# EAGLE design headset_v2 (EAGLE 9.5.1)
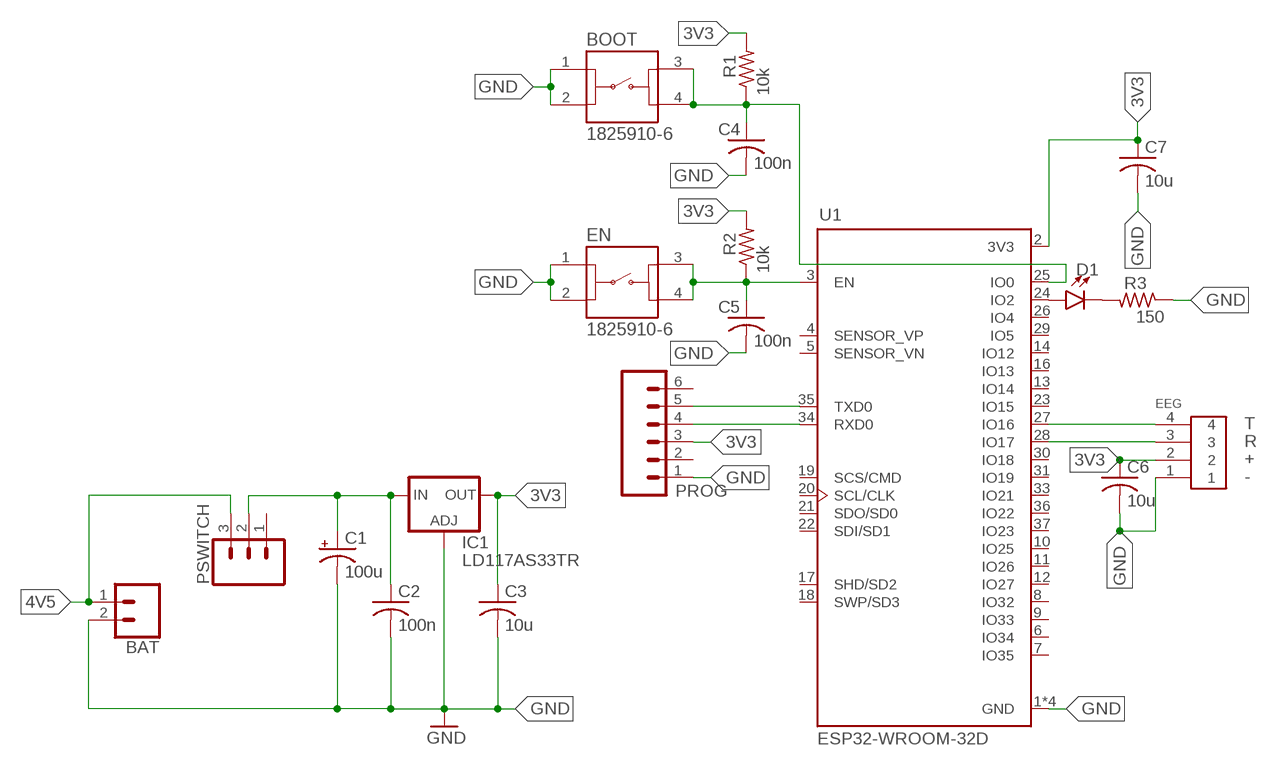
[diagram p0: schematic, sheet 1]

## Parts
BAT  CONN_02  [1X02]
BOOT  1825910-6  [1825910-6]
C1  100u  CPOL-US153CLV-0810  [153CLV-0810]
C2  100n  C-USC0805  [C0805]
C3  10u  C-USC0805  [C0805]
C4  100n  C-USC0805  [C0805]
C5  100n  C-USC0805  [C0805]
C6  10u  C-USC0805  [C0805]
C7  10u  C-USC0805  [C0805]
D1  LED3MM  [LED_3MM]
EEG  2PIN  [B2B-PH-K-S]
EN  1825910-6  [1825910-6]
IC1  LD117AS33TR  [SOT223]
PROG  CONN_06SILK_FEMALE_PTH  [1X06]
PSWITCH  CONN_03  [1X03]
R1  10k  R-US_R0805  [R0805]
R2  10k  R-US_R0805  [R0805]
R3  150  R-US_R0805  [R0805]
U1  ESP32-WROOM-32D  [MODULE_ESP32-WROOM-32D]

## Nets
3V3: C3.1 C6.1 C7.1 EEG.2 IC1.4(OUT) PROG.3 R1.2 R2.2 U1.2(3V3)
4V5: BAT.1 PSWITCH.3
GND: BAT.2 BOOT.1 BOOT.2 C1.- C2.2 C3.2 C4.2 C5.2 C6.2 C7.2 EEG.1 EN.1 EN.2 IC1.1(ADJ) PROG.1 R3.1 U1.1(GND) U1.15(GND) U1.38(GND) U1.39(GND)
N$1: PROG.5 U1.35(TXD0)
N$2: PROG.4 U1.34(RXD0)
N$3: C1.+ C2.1 IC1.3(IN) PSWITCH.2
N$4: D1.A U1.24(IO2)
N$5: EEG.3 U1.28(IO17)
N$6: EEG.4 U1.27(IO16)
N$9: D1.K(C) R3.2
N$10: C5.1 EN.3 EN.4 R2.1 U1.3(EN)
N$14: BOOT.3 BOOT.4 C4.1 R1.1 U1.25(IO0)
Unconnected: PROG.2 PROG.6 PSWITCH.1 U1.4(SENSOR_VP) U1.5(SENSOR_VN) U1.6(IO34) U1.7(IO35) U1.8(IO32) U1.9(IO33) U1.10(IO25) U1.11(IO26) U1.12(IO27) U1.13(IO14) U1.14(IO12) U1.16(IO13) U1.17(SHD/SD2) U1.18(SWP/SD3) U1.19(SCS/CMD) U1.20(SCL/CLK) U1.21(SDO/SD0) U1.22(SDI/SD1) U1.23(IO15) U1.26(IO4) U1.29(IO5) U1.30(IO18) U1.31(IO19) U1.33(IO21) U1.36(IO22) U1.37(IO23)

## Library data of the parts
BAT = SparkFun-Connectors:CONN_02: Multi connection point. Often used as Generic Header-pin footprint for 0.1 inch spaced/style header connections On any of the 0.1 inch spaced packages, you can populate with these: Break Away Headers - Straight <https://www.sparkfun.com/products/116> (PRT-00116) Break Away Male Headers - Right Angle <https://www.sparkfun.com/products/553> (PRT-00553) Female Headers <https://www.sparkfun.com/products/115> (PRT-00115) Break Away Headers - Machine Pin <https://www.sparkfun.com/products/117> (PRT-00117) Break Away Female Headers - Swiss Machine Pin <https://www.sparkfun.com/products/743> (PRT-00743) For SCREWTERMINALS and SPRING TERMINALS visit here: Screw Terimnals on SparkFun.com <https://www.sparkfun.com/search/results?term=Screw+Terminals> (5mm/3.5mm/2.54mm spacing) This device is also useful as a general connection point to wire up your design to another part of your project. Our various solder wires solder well into these plated through hole pads. Hook-Up Wire - Assortment (Stranded, 22 AWG) <https://www.sparkfun.com/products/11375> (PRT-11375) Hook-Up Wire - Assortment (Solid Core, 22 AWG) <https://www.sparkfun.com/products/11367> (PRT-11367) View the entire wire category on our website here <https://www.sparkfun.com/categories/141> Special notes: Molex polarized connector foot print use with: PRT-08233 with associated crimp pins and housings. 2.54_SCREWTERM for use with PRT-10571. 3.5mm Screw Terminal footprints for PRT-08084 5mm Screw Terminal footprints for use with PRT-08432
BOOT EN = Switch:1825910-6: SWITCH TACTILE SPST-NO 0.05A 24V Manufacturer's datasheet <https://www.te.com/commerce/DocumentDelivery/DDEController?Action=srchrtrv&DocNm=1825910&DocType=Customer+Drawing&DocLang=English>; CREATED_BY: PCBLayout.com; DIGIKEY_PART_NUMBER: 450-1650-ND; MANUFACTURER: TE Connectivity ALCOSWITCH Switches; MPN: 1825910-6
C1 = rcl:CPOL-US: POLARIZED CAPACITOR, American symbol; SPICEPREFIX: C
C2-C7 = resistor:C-US: CAPACITOR, American symbol
D1 = SparkFun-LED:LED: LED (Generic) Standard schematic elements and footprints for 5mm, 3mm, 1206, and 0603 sized LEDs. Generic LEDs with no color specified.; PROD_ID: DIO-08794
EEG = jst_eph:2PIN
IC1 = v-reg:LD117A?*: Low drop fixed and adjustable positive voltage regulators 1 A Source: http://www.st.com/stonline/products/literature/ds/7194/ld1117axx.pdf
PROG = SparkFun-Connectors:CONN_06: Multi connection point. Often used as Generic Header-pin footprint for 0.1 inch spaced/style header connections On any of the 0.1 inch spaced packages, you can populate with these: Break Away Headers - Straight <https://www.sparkfun.com/products/116> (PRT-00116) Break Away Male Headers - Right Angle <https://www.sparkfun.com/products/553> (PRT-00553) Female Headers <https://www.sparkfun.com/products/115> (PRT-00115) Break Away Headers - Machine Pin <https://www.sparkfun.com/products/117> (PRT-00117) Break Away Female Headers - Swiss Machine Pin <https://www.sparkfun.com/products/743> (PRT-00743) Arduino Stackable Header - 6 Pin <https://www.sparkfun.com/products/9280> (PRT-09280) For SCREWTERMINALS and SPRING TERMINALS visit here: Screw Terimnals on SparkFun.com <https://www.sparkfun.com/search/results?term=Screw+Terminals> (5mm/3.5mm/2.54mm spacing) This device is also useful as a general connection point to wire up your design to another part of your project. Our various solder wires solder well into these plated through hole pads. Hook-Up Wire - Assortment (Stranded, 22 AWG) <https://www.sparkfun.com/products/11375> (PRT-11375) Hook-Up Wire - Assortment (Solid Core, 22 AWG) <https://www.sparkfun.com/products/11367> (PRT-11367) View the entire wire category on our website here <https://www.sparkfun.com/categories/141>; PROD_ID: CONN-08437
PSWITCH = SparkFun-Connectors:CONN_03: Multi connection point. Often used as Generic Header-pin footprint for 0.1 inch spaced/style header connections On any of the 0.1 inch spaced packages, you can populate with these: Break Away Headers - Straight <https://www.sparkfun.com/products/116> (PRT-00116) Break Away Male Headers - Right Angle <https://www.sparkfun.com/products/553> (PRT-00553) Female Headers <https://www.sparkfun.com/products/115> (PRT-00115) Break Away Headers - Machine Pin <https://www.sparkfun.com/products/117> (PRT-00117) Break Away Female Headers - Swiss Machine Pin <https://www.sparkfun.com/products/743> (PRT-00743) Stackable Header - 3 Pin (Female, 0.1") <https://www.sparkfun.com/products/13875> (PRT-13875) For SCREWTERMINALS and SPRING TERMINALS visit here: Screw Terimnals on SparkFun.com <https://www.sparkfun.com/search/results?term=Screw+Terminals> (5mm/3.5mm/2.54mm spacing) This device is also useful as a general connection point to wire up your design to another part of your project. Our various solder wires solder well into these plated through hole pads. Hook-Up Wire - Assortment (Stranded, 22 AWG) <https://www.sparkfun.com/products/11375> (PRT-11375) Hook-Up Wire - Assortment (Solid Core, 22 AWG) <https://www.sparkfun.com/products/11367> (PRT-11367) View the entire wire category on our website here <https://www.sparkfun.com/categories/141> Special notes: Molex polarized connector foot print use with SKU : PRT-08232 with associated crimp pins and housings.
R1-R3 = rcl:R-US_: RESISTOR, American symbol; SPICEPREFIX: R
U1 = ESP32-WROOM-32D:ESP32-WROOM-32D: IC: SoC; GPIO, I2C, I2S, IR, SD, SDIO, SPI, UART; 2.7÷3.6VDC; 20dBm; AVAILABILITY: Unavailable; DESCRIPTION: IC: SoC; GPIO, I2C, I2S, IR, SD, SDIO, SPI, UART; 2.7÷3.6VDC; 20dBm; MF: Espressif Systems; MP: ESP32-WROOM-32D; PACKAGE: Module Espressif Systems; PRICE: None

## Board
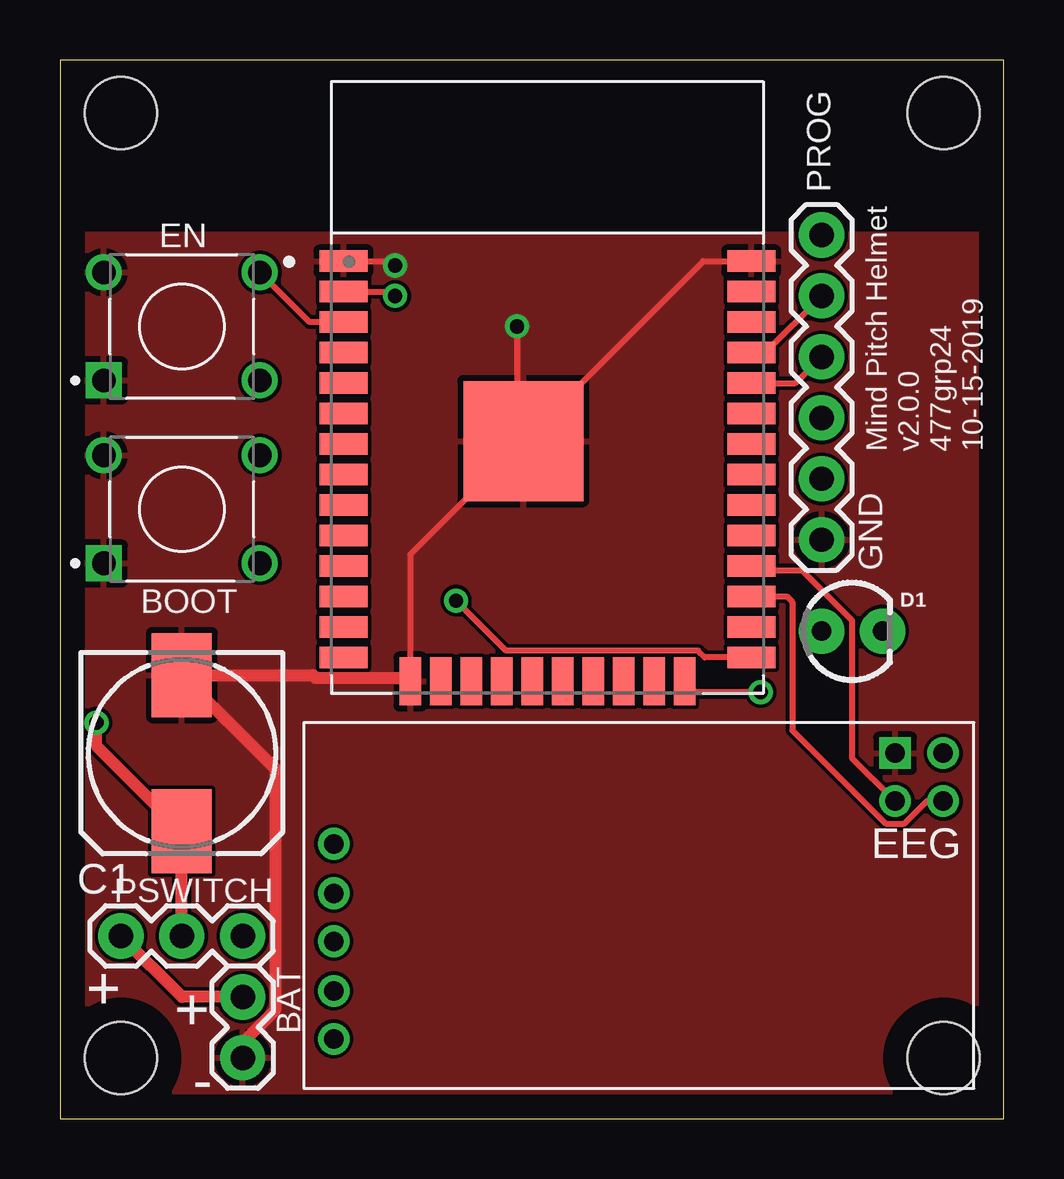
[diagram p1: board, top side]
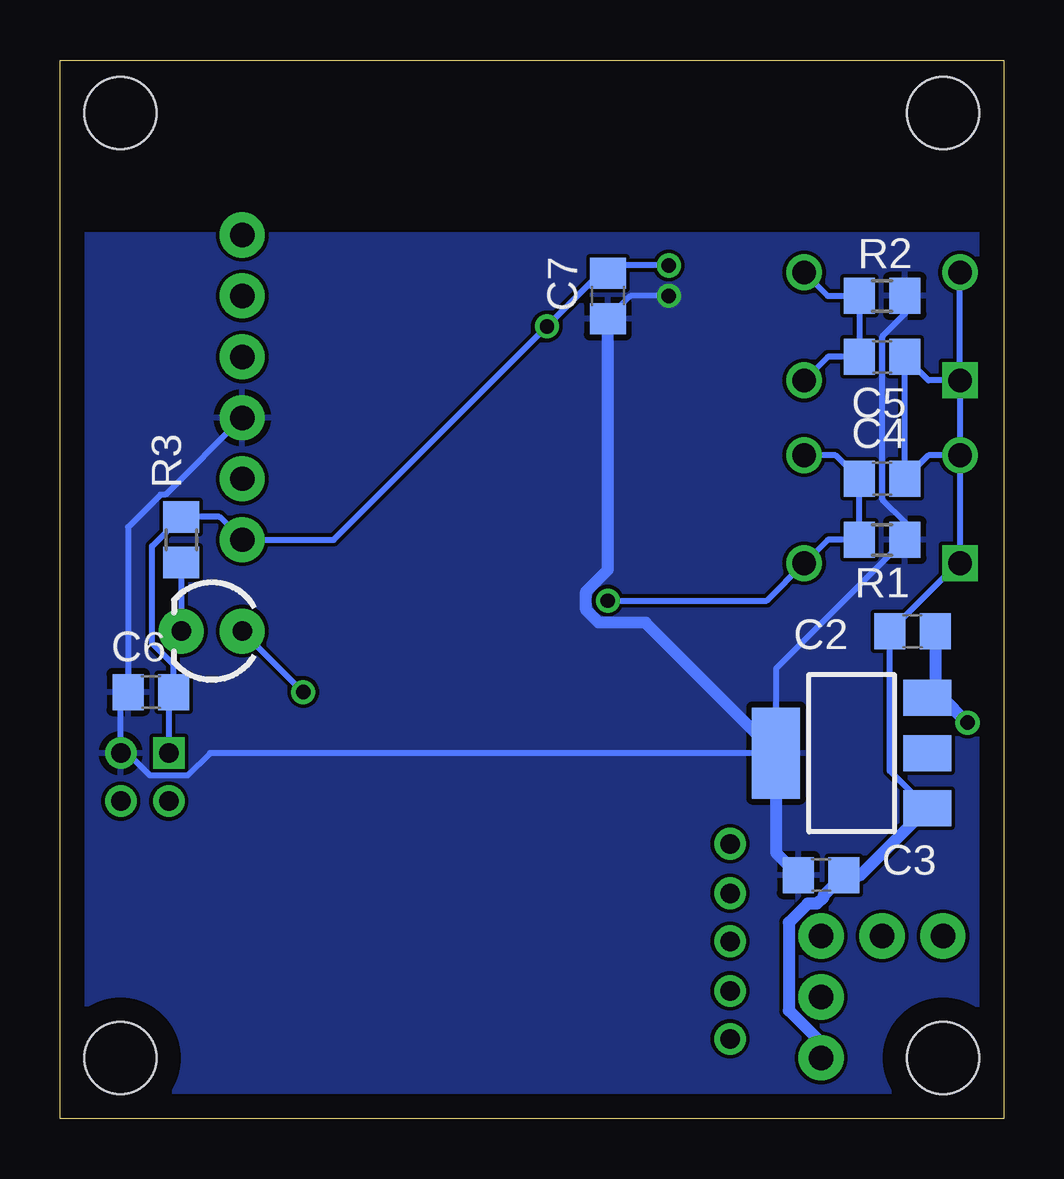
[diagram p2: board, bottom side, seen from below]

Size 39.35 x 44.12 mm. Coordinates in mm from the lower left corner, seen from the top.
Outline: 0,0 39.35,0 39.35,44.12 0,44.12 0,0
Copper layers (1*16): Top 0.035mm / dielectric 1.5mm / Bottom 0.035mm
Design rules "default *": minimum track width 6mil, minimum drill 0.35mm, track to track 6mil, track to pad 6mil, pad to pad 6mil, via to via 6mil, smd to smd 6mil, copper to edge 40mil, drill to drill 6mil, minimum pad ring 10mil, minimum via ring 8mil, stop-mask expansion 4mil, vias tented up to drill 0mil, thermal gap 10mil
Holes 3 mm at 2.54,41.91 36.83,41.91 36.83,2.54 2.54,2.54

### Footprints (pad centres in the part's own frame; a part is rotated, then mirrored left to right if it is on the bottom)
1X02 = drill 1.016 pad 1.88: 1 0,0; 2 2.54,0
1825910-6 = drill 0.99 square: 1 3.25,2.25 | drill 0.99: 2 3.25,-2.25; 3 -3.25,2.25; 4 -3.25,-2.25
153CLV-0810 = smd 3.5 x 2.5: + 3.25,0; - -3.25,0
C0805 = smd 1.3 x 1.5: 1 -0.95,0; 2 0.95,0
LED_3MM = drill 0.813 pad 1.88: A -1.27,0; K 1.27,0
B2B-PH-K-S = drill 0.813 square: 1 11.954,6.35 | drill 0.813: 2 13.954,6.35; 3 11.954,4.35; 4 13.954,4.35; 5 -11.446,-3.556; 6 -11.446,-5.556; 7 -11.446,0.508; 8 -11.446,-1.492; 10 -11.446,2.572
SOT223 = smd 1.5 x 2: 1 -2.3,-3.15; 2 0,-3.15; 3 2.3,-3.15 | smd 3.8 x 2: 4 0,3.15
1X06 = drill 1.016 pad 1.88: 1 0,0; 2 2.54,0; 3 5.08,0; 4 7.62,0; 5 10.16,0; 6 12.7,0
1X03 = drill 1.016 pad 1.88: 1 0,0; 2 2.54,0; 3 5.08,0
R0805 = smd 1.3 x 1.5: 1 -0.95,0; 2 0.95,0
MODULE_ESP32-WROOM-32D = smd 2 x 0.9: 1 -8.5,5.26; 2 -8.5,3.99; 3 -8.5,2.72; 4 -8.5,1.45; 5 -8.5,0.18; 6 -8.5,-1.09; 7 -8.5,-2.36; 8 -8.5,-3.63; 9 -8.5,-4.9; 10 -8.5,-6.17; 11 -8.5,-7.44; 12 -8.5,-8.71; 13 -8.5,-9.98; 14 -8.5,-11.25; 25 8.5,-11.25; 26 8.5,-9.98; 27 8.5,-8.71; 28 8.5,-7.44; 29 8.5,-6.17; 30 8.5,-4.9; 31 8.5,-3.63; 32 8.5,-2.36; 33 8.5,-1.09; 34 8.5,0.18; 35 8.5,1.45; 36 8.5,2.72; 37 8.5,3.99; 38 8.5,5.26 | smd 0.9 x 2: 15 -5.715,-12.25; 16 -4.445,-12.25; 17 -3.175,-12.25; 18 -1.905,-12.25; 19 -0.635,-12.25; 20 0.635,-12.25; 21 1.905,-12.25; 22 3.175,-12.25; 23 4.445,-12.25; 24 5.715,-12.25 | smd 5 x 5: 39 -1,-2.24

### Placement (x,y rotation side)
BAT  7.62,5.08 270 top
BOOT  5.08,25.4 180 top
C1  5.08,15.24 270 top
C2  3.81,20.32 180 bottom
C3  7.62,10.16 0 bottom
C4  5.08,26.67 0 bottom
C5  5.08,31.75 0 bottom
C6  35.56,17.78 0 bottom
C7  16.51,34.29 90 bottom
D1  33.02,20.32 0 top
EEG  22.86,8.89 0 top
EN  5.08,33.02 180 top
IC1  6.35,15.24 90 bottom
PROG  31.75,24.13 90 top
PSWITCH  7.62,7.62 180 top
R1  5.08,24.13 0 bottom
R2  5.08,34.29 0 bottom
R3  34.29,24.13 270 bottom
U1  20.32,30.48 0 top

### Tracks (layer width: path | path; a pad name or v marks a point on that pad's centre or on a via)
3V3  (via drill 0.6)
  Top 0.254: U1.2 13.79,34.47 v13.97,34.29
  Bottom 0.254: R2.2 4.13,33.55 5.06,32.62 5.06,25.8 4.13,24.88 R1.2 9.5,18.76 9.5,15.53 9.21,15.24 | v13.97,34.29 15.56,34.29 C7.1 | PROG.3 34.95,26.01 35.16,26.01 36.51,24.66 C6.1 36.81,17.48 EEG.2 36.53,15.24 35.59,14.3 34.04,14.3 33.1,15.24 IC1.4
  Bottom 0.508: 9.21,15.24 IC1.4 | C7.1 16.51,22.88 17.42,21.97 17.42,21.21 16.89,20.68 14.94,20.68 IC1.4 | IC1.4 9.5,11.09 C3.1
  pour Bottom: 0,0 39.37,0 39.37,36.83 0,36.83
4V5
  Top 0.508: BAT.1 5.08,5.08 PSWITCH.3
GND  (via drill 0.6)
  Top 0.254: U1.15 14.61,23.52 19.05,27.97 | 19.05,27.97 U1.39 26.82,35.74 U1.38 | U1.1 13.79,35.74 v13.97,35.56 | v19.05,33.02 19.05,27.97
  Top 0.508: BAT.2 7.62,3.18 8.97,4.52 8.97,14.6 C1.- 10.54,18.49 10.65,18.37 14.46,18.37 U1.15
  Bottom 0.254: BOOT.2 BOOT.1 1.93,23.15 C2.2 4.76,14.5 IC1.1 | EN.1 BOOT.2 | EN.1 EN.2 | EN.1 3.15,30.77 C5.2 C4.2 3.15,27.65 BOOT.2 | EEG.1 34.81,17.58 C6.2 34.61,18.92 35.51,19.82 35.51,23.86 R3.1 32.7,25.08 PROG.1 27.94,24.13 v19.05,33.02 16.83,35.24 C7.2 16.19,35.56 v13.97,35.56
  Bottom 0.508: IC1.1 5.98,10.16 C3.2 7.51,9.32 7.51,9.24 7.79,8.97 8.18,8.97 8.97,8.18 8.97,4.52 7.62,3.18 BAT.2
  pour Top: 0,36.83 0,0 39.37,0 39.37,36.83
N$1
  Top 0.254: U1.35 29.39,31.93 PROG.5
N$2
  Top 0.254: PROG.4 30.66,30.66 U1.34
N$3  (via drill 0.6)
  Top 0.508: PSWITCH.2 C1.+ 1.52,15.55 v1.52,16.51
  Bottom 0.508: C2.1 2.86,17.88 IC1.3 2.55,17.54 v1.52,16.51
N$4  (via drill 0.6)
  Top 0.254: v29.21,17.78 26.48,17.78 U1.24
  Bottom 0.254: D1.A v29.21,17.78
N$5
  Top 0.254: U1.28 29,22.86 30.93,22.86 33.02,20.77 33.02,15.03 EEG.3
N$6
  Top 0.254: U1.27 30.3,21.77 30.53,21.54 30.53,16.19 34.42,12.3 35.2,12.3 36.14,13.24 EEG.4
N$9
  Bottom 0.254: R3.2 D1.K
N$10
  Top 0.254: U1.3 10.4,33.2 EN.4
  Bottom 0.254: EN.3 7.35,31.75 C5.1 R2.1 7.35,34.29 EN.4
N$14  (via drill 0.6)
  Top 0.254: v16.51,21.59 18.59,19.51 26.6,19.51 26.88,19.23 U1.25
  Bottom 0.254: BOOT.4 7.01,27.65 C4.1 R1.1 7.35,24.13 BOOT.3 9.89,21.59 v16.51,21.59

### Text on the board
tNames: Mind Pitch Helmet / v2.0.0 / 477grp24 / 10-15-2019 | GND | + | + | -